# Altium schematic sheet MCU.SchDoc
size A
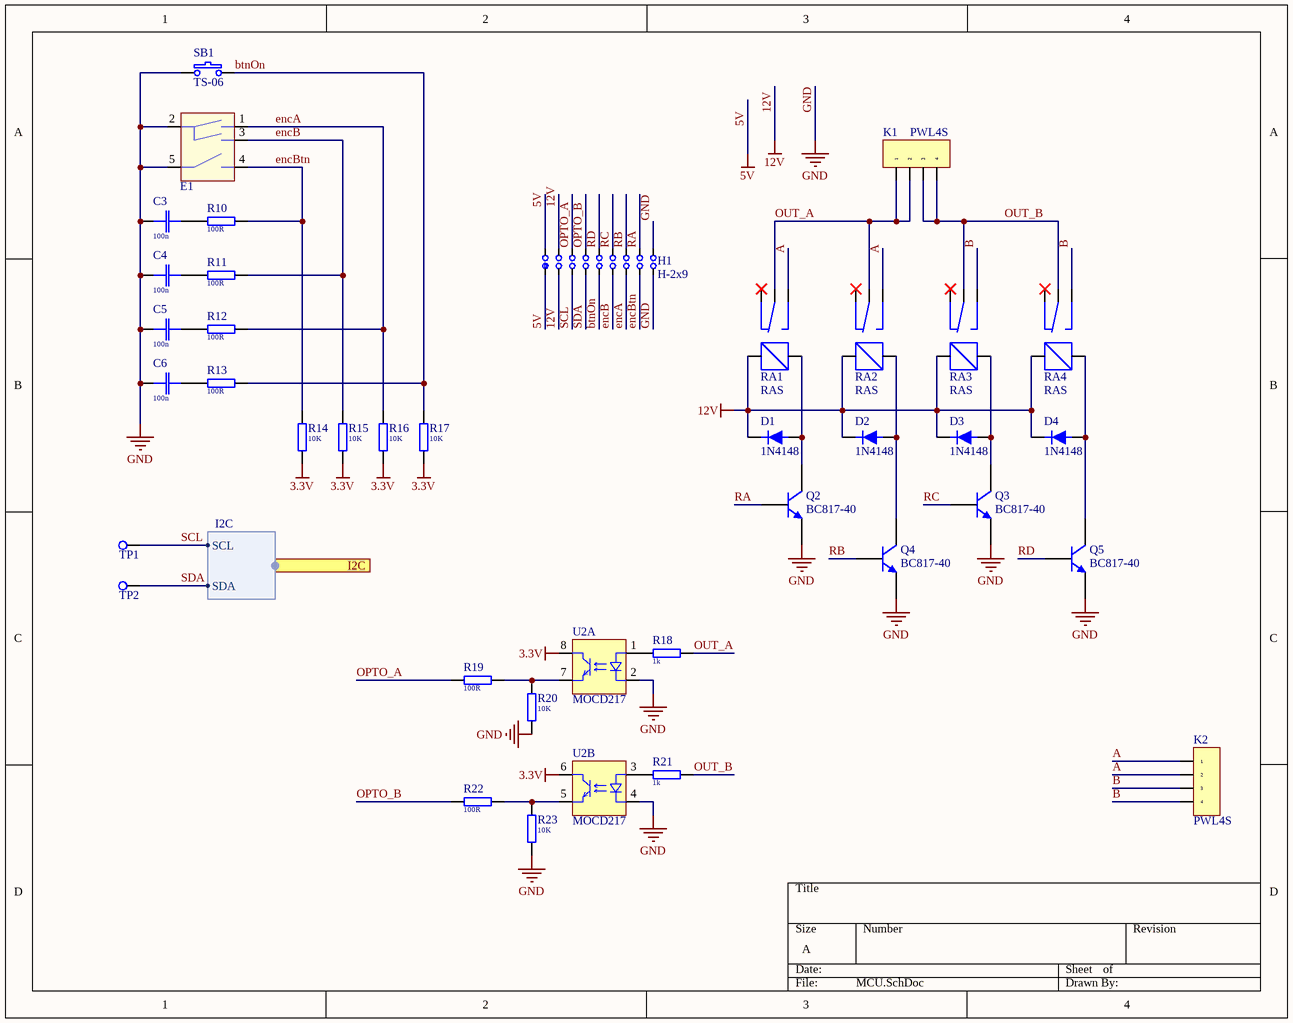
[diagram p0: MCU.SchDoc]

## Parts
C3  100n  [C0805(2013)]
C4  100n  [C0805(2013)]
C5  100n  [C0805(2013)]
C6  100n  [C0805(2013)]
D1  1N4148  [DO-214AC (SMA)]
D2  1N4148  [DO-214AC (SMA)]
D3  1N4148  [DO-214AC (SMA)]
D4  1N4148  [DO-214AC (SMA)]
E1  Encoder SW  [PEC12]  (value not drawn)
H1  H-2x9  [J2x9]
K1  PWL4S  [PWL4S]
K2  PWL4S  [PWL4S]
Q2  BC817-40  [SOT23_N]
Q3  BC817-40  [SOT23_N]
Q4  BC817-40  [SOT23_N]
Q5  BC817-40  [SOT23_N]
R10  100R  [R0805]
R11  100R  [R0805]
R12  100R  [R0805]
R13  100R  [R0805]
R14  10K  [R0805]
R15  10K  [R0805]
R16  10K  [R0805]
R17  10K  [R0805]
R18  1k  [R0805]
R19  100R  [R0805]
R20  10K  [R0805]
R21  1k  [R0805]
R22  100R  [R0805]
R23  10K  [R0805]
RA1  RAS  [Rele RAS]
RA2  RAS  [Rele RAS]
RA3  RAS  [Rele RAS]
RA4  RAS  [Rele RAS]
SB1  TS-06  [TS-06]
TP1  TP  [TP_TH]  (value not drawn)  (no BOM)
TP2  TP  [TP_TH]  (value not drawn)  (no BOM)
U2  MOCD217  [SO-8 (MOCD217)]  (parts A,B of 2)

## Ports
I2C (harness I2C)

## Harnesses
I2C: SCL, SDA

## Nets
3.3V: R14.1 R15.1 R16.1 R17.1 U2.6(C) U2.8(C)
5V: H1.1 H1.2
12V: D1.2(C) D2.2(C) D3.2(C) D4.2(C) H1.3 H1.4 RA1.1(a) RA2.1(a) RA3.1(a) RA4.1(a)
GND: C3.2 C4.2 C5.2 C6.2 E1.2 E1.5 H1.17 H1.18 Q2.2(E) Q3.2(E) Q4.2(E) Q5.2(E) R20.2 R23.1 SB1.1 U2.2(K) U2.4(K)
A: K2.1 K2.2 RA1.5(NO) RA2.5(NO)
B: K2.3 K2.4 RA3.5(NO) RA4.5(NO)
btnOn: H1.9 R13.1 R17.2 SB1.2
encA: E1.1 H1.13 R12.1 R16.2
encB: E1.3 H1.11 R11.1 R15.2
encBtn: E1.4 H1.15 R10.1 R14.2
OPTO_A: H1.6 R19.2
OPTO_B: H1.8 R22.2
OUT_A: K1.1 K1.2 R18.1 RA1.4(O) RA2.4(O)
OUT_B: K1.3 K1.4 R21.1 RA3.4(O) RA4.4(O)
RA: H1.16 Q2.1(B)
RB: H1.14 Q4.1(B)
RC: H1.12 Q3.1(B)
RD: H1.10 Q5.1(B)
SCL: H1.5 TP1.1 ; port I2C.SCL
SDA: H1.7 TP2.1 ; port I2C.SDA
NetC3_1: C3.1 R10.2
NetC4_1: C4.1 R11.2
NetC5_1: C5.1 R12.2
NetC6_1: C6.1 R13.2
NetD1_1: D1.1(A) Q2.3(C) RA1.2(b)
NetD2_1: D2.1(A) Q4.3(C) RA2.2(b)
NetD3_1: D3.1(A) Q3.3(C) RA3.2(b)
NetD4_1: D4.1(A) Q5.3(C) RA4.2(b)
NetR18_2: R18.2 U2.1(A)
NetR19_1: R19.1 R20.1 U2.7(E)
NetR21_2: R21.2 U2.3(A)
NetR22_1: R22.1 R23.2 U2.5(E)

Not connected (* = marked no-connect by the designer): RA1 3(NC)*; RA2 3(NC)*; RA3 3(NC)*; RA4 3(NC)*

## Library data of the parts
C3-C6 = C-0805   50V 100n: SMD-0805 50V Y5V +80/-20%; Price: 0.05; Value: 100n
D1-D4 = 1N4148: DO-35 75V 0.2A 1uS 4A 4nS; Price: 0.02
E1 = Encoder SW: Mechanical encoder with switch; Sim Note: Enter the Resistance value and the set point into parameter fields.; Set Position: 0.5; Published: 8-Jun-2000; LatestRevisionDate: 17-Jul-2002; LatestRevisionNote: Re-released for DXP Platform.; PackageReference: VR5; Publisher: Altium Limited
K1 K2 = PWL4S: 3.96mm 7A/250V; Price: 0.17
Q2-Q5 = BC817-40: NPN General-purpose Transistor; Published: 17-Sep-2003; LatestRevisionDate: 12-Dec-2006; LatestRevisionNote: IPC-7351 Footprint Added.; DatasheetVersion: Jun-1999; PackageVersion: May-1999; PackageReference: SOT23; Publisher: Altium Limited; PackageDescription: 3-Pin SOT-23 Package 0.95 mm Pitch, 2.3 mm Lead Span; ComponentLink1Description: Manufacturer Link; ComponentLink1URL: http://www.semiconductors.philips.com/; ComponentLink2Description: Datasheet; ComponentLink2URL: http://www.semiconductors.philips.com/acrobat/datasheets/BC817_BC817W_BC337_5.pdf
R10-R23 = R-0805: SMD 0805 0.1W 5% 150V; Price: 0.017
  R10-R13 R19 R22: Value: 100R
  R14-R17 R20 R23: Value: 10K
  R18 R21: Value: 1k
RA1-RA4 = Relay RAS: AC-120V 15A DC-14V 20A 30V 15A /0.36W; Price: 1.8
SB1 = Buton TS-06: Price: 0.15
TP1 TP2 = TP: Test point
U2 = MOCD217: Dual optocouple
H1 = H-2x9: Price: 0.18